# Altium schematic sheet 2016-07-11_00-51-471.schdoc
size 405 x 220 mm; SheetNumber: 1; SheetTotal: 1
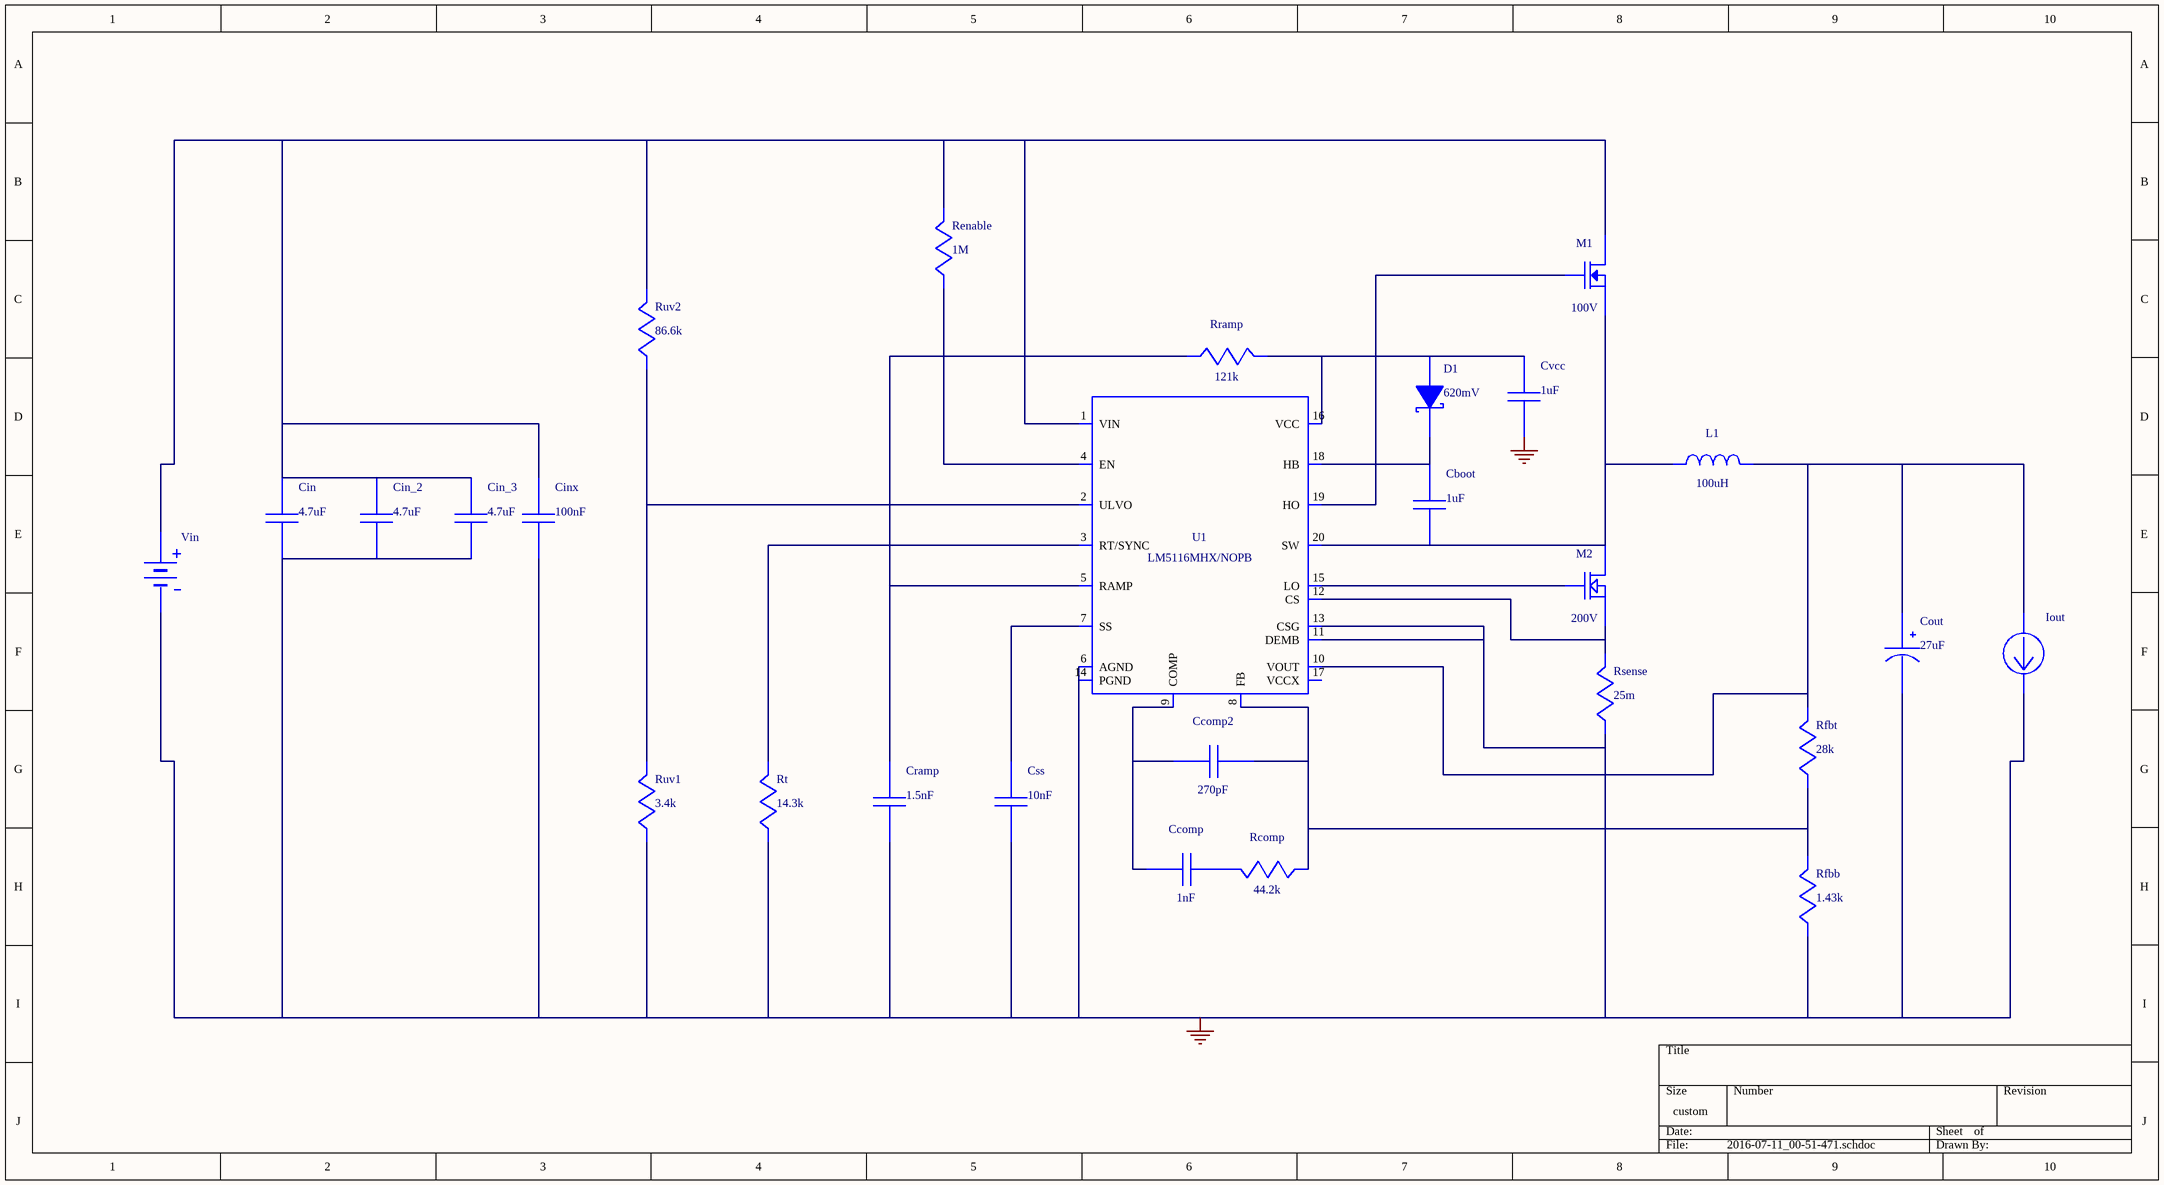
[diagram p0: 2016-07-11_00-51-471.schdoc]

## Parts
Cboot  value 1uF  (hidden comment: EMK212B7105KG-T)
Ccomp  value 1nF  (hidden comment: CL21C102JBCNFNC)
Ccomp2  value 270pF  (hidden comment: CC0805KRX7R9BB271)
Cin  value 4.7uF  (hidden comment: C3225X7S2A475M200AB)
Cin_2  value 4.7uF  (hidden comment: C3225X7S2A475M200AB)
Cin_3  value 4.7uF  (hidden comment: C3225X7S2A475M200AB)
Cinx  value 100nF  (hidden comment: HMK212B7104KG-T)
Cout  value 27uF  (hidden comment: UUD1V270MCL1GS)
Cramp  value 1.5nF  (hidden comment: CC0805KRX7R9BB152)
Css  value 10nF  (hidden comment: GRM216R71H103KA01D)
Cvcc  value 1uF  (hidden comment: EMK212B7105KG-T)
D1  value 620mV  (hidden comment: SS2PH10-M3)
Iout  WB_CURRENT_LOAD  (value not drawn)
L1  value 100uH  (hidden comment: MSS1210-104KEB)
M1  value 100V  (hidden comment: CSD19534Q5A)
M2  value 200V  (hidden comment: BSC320N20NS3 G)
Rcomp  value 44.2k  (hidden comment: ERJ-6ENF4422V)
Renable  value 1M  (hidden comment: ERJ-6ENF1004V)
Rfbb  value 1.43k  (hidden comment: ERJ-6ENF1431V)
Rfbt  value 28k  (hidden comment: ERJ-6ENF2802V)
Rramp  value 121k  (hidden comment: ERJ-6ENF1213V)
Rsense  value 25m  (hidden comment: CSR1206FK25L0)
Rt  value 14.3k  (hidden comment: ERJ-6ENF1432V)
Ruv1  value 3.4k  (hidden comment: ERJ-6ENF3401V)
Ruv2  value 86.6k  (hidden comment: ERJ-6ENF8662V)
U1  LM5116MHX/NOPB
Vin  WB_BATTERY  (value not drawn)

## Nets
0: Cin.2 Cin_2.2 Cin_3.2 Cinx.2 Cout.2(-) Cramp.2 Css.2 Cvcc.2 Iout.2(-) Rfbb.2 Rsense.2 Rt.2 Ruv1.2 U1.6(AGND) U1.11(DEMB) U1.13(CSG) U1.14(PGND) U1.21(EP) Vin.2(-)
NetCboot_1: Cboot.1 D1.1(K) U1.18(HB)
NetCboot_2: Cboot.2 L1.1 M1.1(Source) M1.2(Source) M1.3(Source) M2.5(Drain) M2.6(Drain) M2.7(Drain) M2.8(Drain) M2.9(Drain) U1.20(SW)
NetCcomp2_2: Ccomp2.2 Rcomp.2 Rfbb.1 Rfbt.2 U1.8(FB)
NetCcomp_1: Ccomp.1 Ccomp2.1 U1.9(COMP)
NetCcomp_2: Ccomp.2 Rcomp.1
NetCin_1: Cin.1 Cin_2.1 Cin_3.1 Cinx.1 M1.5(Drain) M1.6(Drain) M1.7(Drain) M1.8(Drain) M1.9(Drain) Renable.1 Ruv2.1 U1.1(VIN) Vin.1(+)
NetCout_1: Cout.1(+) Iout.1(+) L1.2 Rfbt.1 U1.10(VOUT)
NetCramp_1: Cramp.1 Rramp.2 U1.5(RAMP)
NetCss_1: Css.1 U1.7(SS)
NetCvcc_1: Cvcc.1 D1.2(A) Rramp.1 U1.16(VCC)
NetM1_4: M1.4(Gate) U1.19(HO)
NetM2_1: M2.1(Source) M2.2(Source) M2.3(Source) Rsense.1 U1.12(CS)
NetM2_4: M2.4(Gate) U1.15(LO)
NetRenable_2: Renable.2 U1.4(EN)
NetRt_1: Rt.1 U1.3(RT/SYNC)
NetRuv1_1: Ruv1.1 Ruv2.2 U1.2(ULVO)

Not connected (* = marked no-connect by the designer): U1 17(VCCX)

## Library data of the parts
Cboot Cvcc = EMK212B7105KG-T: Manufacturer Name: Taiyo Yuden; PackageReference: EMK212B7105KG-T; Manufacturer Part Number: EMK212B7105KG-T
Ccomp = CL21C102JBCNFNC: Manufacturer Name: Samsung Electro-Mechanics; PackageReference: CL21C102JBCNFNC; Manufacturer Part Number: CL21C102JBCNFNC
Ccomp2 = CC0805KRX7R9BB271: CC0805KRX7R9BB27; Manufacturer Name: Yageo America; PackageReference: CC0805KRX7R9BB271; Manufacturer Part Number: CC0805KRX7R9BB271
Cin Cin_2 Cin_3 = C3225X7S2A475M200AB: C3225X7S2A475M20; Manufacturer Name: TDK; PackageReference: C3225X7S2A475M200AB; Manufacturer Part Number: C3225X7S2A475M200AB
Cinx = HMK212B7104KG-T: Manufacturer Name: Taiyo Yuden; PackageReference: HMK212B7104KG-T; Manufacturer Part Number: HMK212B7104KG-T
Cout = UUD1V270MCL1GS: Manufacturer Name: Nichicon; PackageReference: UUD1V270MCL1GS; Manufacturer Part Number: UUD1V270MCL1GS
Cramp = CC0805KRX7R9BB152: CC0805KRX7R9BB15; Manufacturer Name: Yageo America; PackageReference: CC0805KRX7R9BB152; Manufacturer Part Number: CC0805KRX7R9BB152
Css = GRM216R71H103KA01D: GRM216R71H103KA0; Manufacturer Name: MuRata; PackageReference: GRM216R71H103KA01D; Manufacturer Part Number: GRM216R71H103KA01D
D1 = SS2PH10-M3: Manufacturer Name: Vishay-Semiconductor; PackageReference: SS2PH10-M3; Manufacturer Part Number: SS2PH10-M3
L1 = MSS1210-104KEB: Unknown; Manufacturer Name: Coilcraft; PackageReference: MSS1210-104KEB; Manufacturer Part Number: MSS1210-104KEB
M1 = CSD19534Q5A: Manufacturer Name: Texas Instruments; PackageReference: CSD19534Q5A; Manufacturer Part Number: CSD19534Q5A
M2 = BSC320N20NS3 G: Manufacturer Name: Infineon Technologies; PackageReference: BSC320N20NS3 G; Manufacturer Part Number: BSC320N20NS3 G
Rcomp = ERJ-6ENF4422V: Manufacturer Name: Panasonic; PackageReference: ERJ-6ENF4422V; Manufacturer Part Number: ERJ-6ENF4422V
Renable = ERJ-6ENF1004V: Manufacturer Name: Panasonic; PackageReference: ERJ-6ENF1004V; Manufacturer Part Number: ERJ-6ENF1004V
Rfbb = ERJ-6ENF1431V: Manufacturer Name: Panasonic; PackageReference: ERJ-6ENF1431V; Manufacturer Part Number: ERJ-6ENF1431V
Rfbt = ERJ-6ENF2802V: Manufacturer Name: Panasonic; PackageReference: ERJ-6ENF2802V; Manufacturer Part Number: ERJ-6ENF2802V
Rramp = ERJ-6ENF1213V: Manufacturer Name: Panasonic; PackageReference: ERJ-6ENF1213V; Manufacturer Part Number: ERJ-6ENF1213V
Rsense = CSR1206FK25L0: Manufacturer Name: Stackpole Electronics Inc; PackageReference: CSR1206FK25L0; Manufacturer Part Number: CSR1206FK25L0
Rt = ERJ-6ENF1432V: Manufacturer Name: Panasonic; PackageReference: ERJ-6ENF1432V; Manufacturer Part Number: ERJ-6ENF1432V
Ruv1 = ERJ-6ENF3401V: Manufacturer Name: Panasonic; PackageReference: ERJ-6ENF3401V; Manufacturer Part Number: ERJ-6ENF3401V
Ruv2 = ERJ-6ENF8662V: Manufacturer Name: Panasonic; PackageReference: ERJ-6ENF8662V; Manufacturer Part Number: ERJ-6ENF8662V
U1 = LM5116MHX/NOPB: Manufacturer Name: Texas Instruments; PackageReference: LM5116MHX/NOPB; Manufacturer Part Number: LM5116MHX/NOPB; Value: N/A
Iout = WB_CURRENT_LOAD: PackageReference: WB_CURRENT_LOAD; Manufacturer Part Number: WB_CURRENT_LOAD; Manufacturer Name: WB_CURRENT_LOAD; Value: N/A
Vin = WB_BATTERY: PackageReference: WB_BATTERY; Manufacturer Part Number: WB_BATTERY; Manufacturer Name: WB_BATTERY; Value: N/A